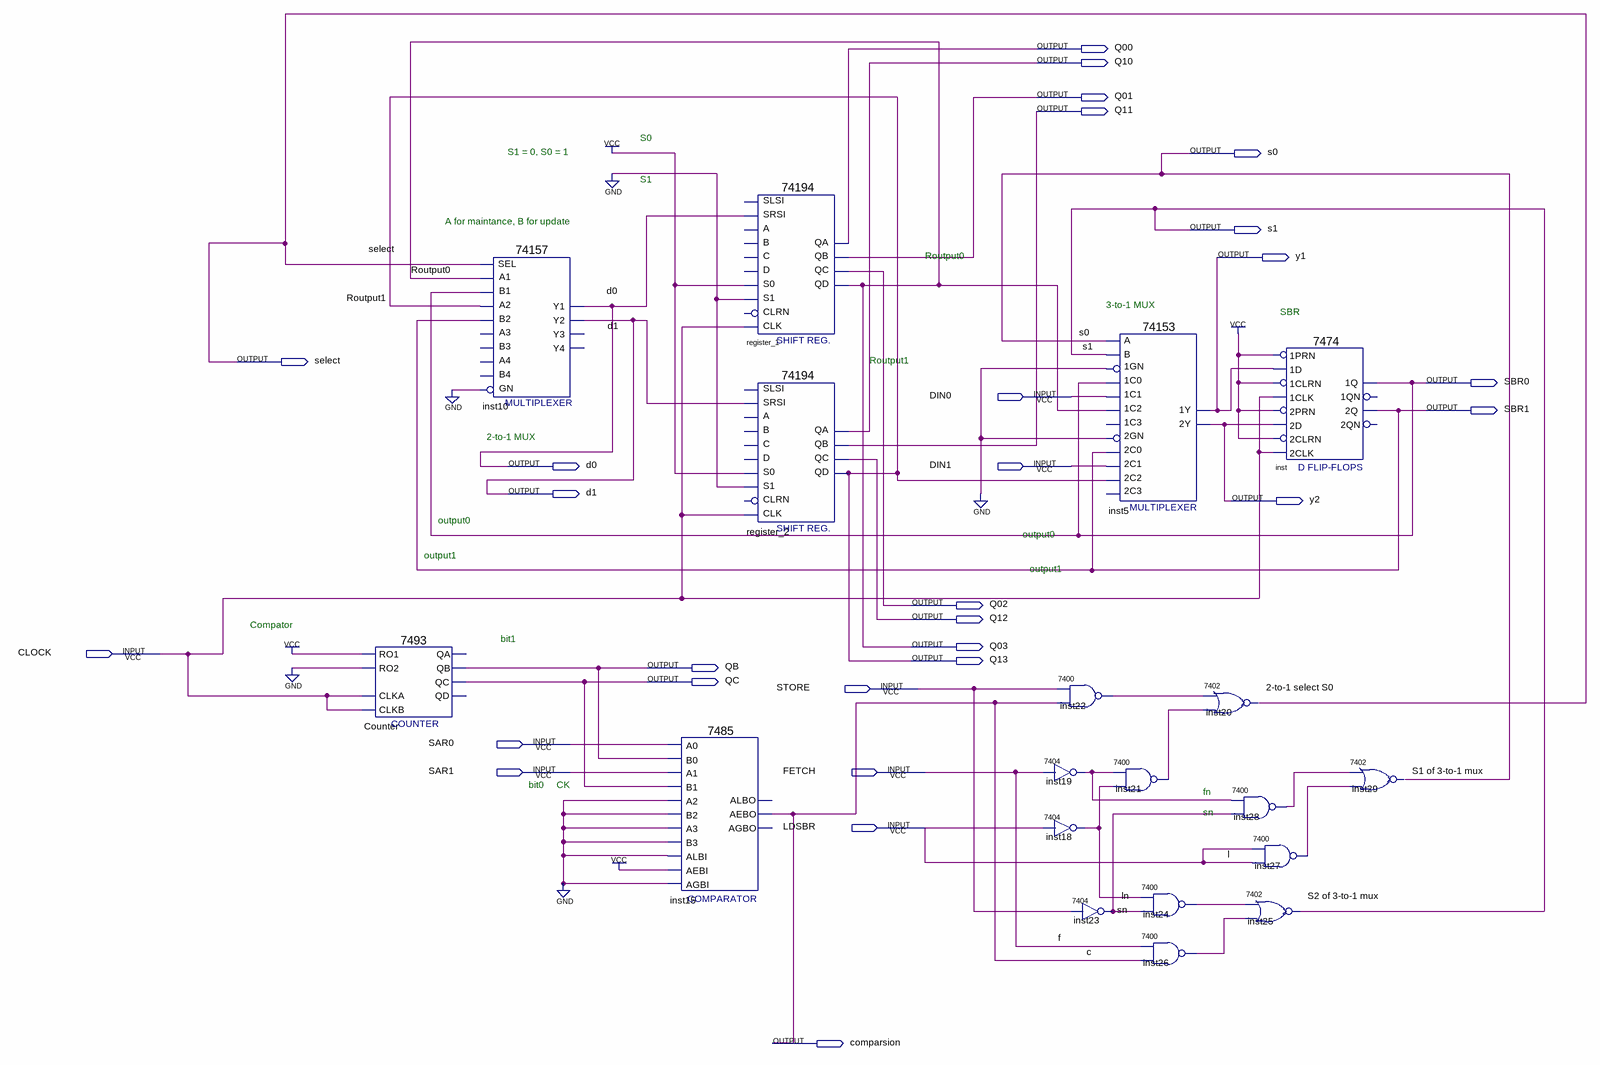
[diagram p0: schematic sheet]
// Quartus schematic Lab2.bdf as structural Verilog: 19 symbols, 28 pins
module Lab2 (
  input  DIN0,
  input  DIN1,
  input  CLOCK,
  input  STORE,
  input  SAR0,
  input  SAR1,
  input  FETCH,
  input  LDSBR,
  output Q00,
  output Q10,
  output Q01,
  output Q11,
  output s0,
  output s1,
  output y1,
  output select,
  output SBR0,
  output SBR1,
  output d0,
  output d1,
  output y2,
  output Q02,
  output Q12,
  output Q03,
  output Q13,
  output QB,
  output QC,
  output comparsion
);

  wire inst19_1, inst21_1, inst22_1, inst24_1, inst26_1, inst27_1, inst28_1, ln, sn;

  \7493  Counter (.RO1(1'b1), .RO2(1'b0), .CLKA(CLOCK), .CLKB(CLOCK), .QC(QC), .QB(QB));  // open: QA, QD
  \74157  inst10 (
    .A1(Q03), .B1(SBR0), .SEL(select), .B2(SBR1), .A2(Q13), .GN(1'b0), .Y2(d1), .Y1(d0));  // open: A3, B3, B4, A4, Y4, Y3
  \7485  inst15 (
    .A3(1'b0), .B2(1'b0), .A2(1'b0), .AEBI(1'b1), .AGBI(1'b0), .ALBI(1'b0), .A0(SAR0), .B0(QB), .B3(1'b0),
    .A1(SAR1), .B1(QC), .AEBO(comparsion));  // open: ALBO, AGBO
  \74194  register_1 (
    .SRSI(d0), .CLK(CLOCK), .S1(1'b0), .S0(1'b1), .QA(Q00), .QB(Q01), .QC(Q02), .QD(Q03));  // open: SLSI, B, C, CLRN, D, A
  \74194  register_2 (
    .SRSI(d1), .CLK(CLOCK), .S1(1'b0), .S0(1'b1), .QA(Q10), .QB(Q11), .QC(Q12), .QD(Q13));  // open: SLSI, B, C, CLRN, D, A
  \7400  inst22 (.\3 (comparsion), .\2 (STORE), .\1 (inst22_1));
  \7404  inst19 (.\2 (FETCH), .\1 (inst19_1));
  \7404  inst18 (.\2 (LDSBR), .\1 (ln));
  \7404  inst23 (.\2 (STORE), .\1 (sn));
  \74153  inst5 (
    .\1C1 (DIN0), .\1GN (1'b0), .\1C0 (SBR0), .\2C0 (SBR1), .\2GN (1'b0), .\2C2 (Q13), .\1C2 (Q03), .B(s1),
    .A(s0), .\2C1 (DIN1), .\1Y (y1), .\2Y (y2));  // open: 1C3, 2C3
  \7400  inst21 (.\3 (ln), .\2 (inst19_1), .\1 (inst21_1));
  \7400  inst24 (.\3 (sn), .\2 (ln), .\1 (inst24_1));
  \7400  inst26 (.\3 (comparsion), .\2 (FETCH), .\1 (inst26_1));
  \7402  inst20 (.\2 (inst22_1), .\3 (inst21_1), .\1 (select));
  \7400  inst28 (.\3 (sn), .\2 (inst19_1), .\1 (inst28_1));
  \7400  inst27 (.\3 (LDSBR), .\2 (LDSBR), .\1 (inst27_1));
  \7402  inst25 (.\2 (inst24_1), .\3 (inst26_1), .\1 (s1));
  \7474  inst (
    .\2D (y2), .\2PRN (1'b1), .\1CLK (CLOCK), .\1D (y1), .\1PRN (1'b1), .\2CLK (CLOCK), .\2CLRN (1'b1),
    .\1CLRN (1'b1), .\2Q (SBR1), .\1Q (SBR0));  // open: 1QN, 2QN
  \7402  inst29 (.\2 (inst28_1), .\3 (inst27_1), .\1 (s0));

  // Other names for the same wires on the sheet: c = comparsion; f = FETCH; l = LDSBR; Routput0 = Q03; Routput1 = Q13;
  //   S1 of 3-to-1 mux = s0; S2 of 3-to-1 mux = s1; 2-to-1 select S0 = select

  // Notes on the sheet:
  //   S0
  //   S1 = 0, S0 = 1
  //   S1
  //   A for maintance, B for update
  //   Routput0
  //   3-to-1 MUX
  //   SBR
  //   Routput1
  //   2-to-1 MUX
  //   output0
  //   output0
  //   output1
  //   output1
  //   Compator
  //   bit1
  //   bit0
  //   CK
  //   fn
  //   sn
endmodule
